# EAGLE design power_board (EAGLE 9.3.2)
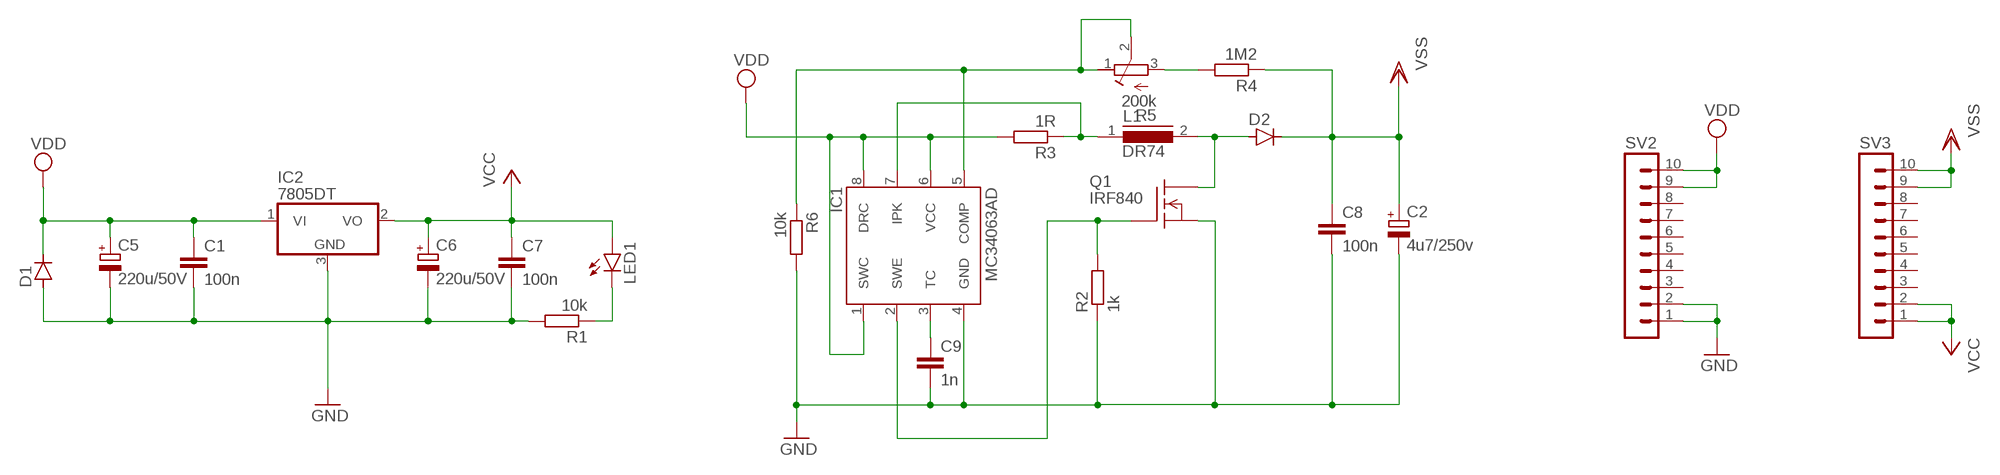
[diagram p0: schematic, sheet 1]

## Parts
C1  100n  C-EUC1206  [C1206]
C2  4u7/250v  CPOL-EUE5-10.5  [E5-10,5]
C5  220u/50V  CPOL-EU153CLV-1010  [153CLV-1010]
C6  220u/50V  CPOL-EU153CLV-1010  [153CLV-1010]
C7  100n  C-EUC1206  [C1206]
C8  100n  C-EUC1206  [C1206]
C9  1n  C-EUC1206  [C1206]
D1  D-SOD-80  [SOD80]
D2  D-SOD-80  [SOD80]
IC1  MC34063AD  [SO08]
IC2  7805DT  [TO252]
L1  DR74  [DR74]
LED1  LEDSMT1206  [1206]
Q1  IRF840  [TO220]
R1  10k  R-EU_R1206  [R1206]
R2  1k  R-EU_R1206  [R1206]
R3  1R  R-EU_R1206  [R1206]
R4  1M2  R-EU_R1206  [R1206]
R5  200k  R-TRIMM43P  [RTRIM43P]
R6  10k  R-EU_R1206  [R1206]
SV2  MA10-1  [MA10-1]
SV3  MA10-1  [MA10-1]

## Nets
GND: C1.2 C2.- C5.- C6.- C7.2 C8.2 C9.2 D1.2(A) IC1.4(GND) IC2.3(GND) Q1.3(S) R1.2 R2.1 R6.2 SV2.1 SV2.2
N$1: LED1.C R1.1
N$2: IC1.5(COMP) R5.1(E) R5.2(S) R6.1
N$3: IC1.7(IPK) L1.1 R3.1
N$4: D2.2(A) L1.2 Q1.2(D)
N$5: C9.1 IC1.3(TC)
N$7: IC1.2(SWE) Q1.1(G) R2.2
N$8: R4.2 R5.3(A)
VCC: C6.+ C7.1 IC2.2(VO) LED1.A SV3.1 SV3.2
VDD: C1.1 C5.+ D1.1(C) IC1.1(SWC) IC1.6(VCC) IC1.8(DRC) IC2.1(VI) R3.2 SV2.9 SV2.10
VSS: C2.+ C8.1 D2.1(C) R4.1 SV3.9 SV3.10
Unconnected: SV2.3 SV2.4 SV2.5 SV2.6 SV2.7 SV2.8 SV3.3 SV3.4 SV3.5 SV3.6 SV3.7 SV3.8

## Library data of the parts
C1 C7-C9 = rcl:C-EU: CAPACITOR, European symbol; SPICEPREFIX: C
C2 C5 C6 = rcl:CPOL-EU: POLARIZED CAPACITOR, European symbol; SPICEPREFIX: C
D1 D2 = semicon-smd-ipc:D-: DIODE unfilled
IC1 = v-reg-3:MC34063A: 1.5A Step-Up/Down/Inverting Switching Regulator NPN Darlington Switch, Vin 3V to 40V, Current Limiter Input, adjustable Frequency up to 100kHz
IC2 = linear:78*: Positive VOLTAGE REGULATOR Source: http://cache.national.com/ds/LM/LM78L05.pdf http://www.fairchildsemi.com/ds/LM/LM7805.pdf
L1 = inductors:DR74: High Power Density, High Efficiency, Shielded Inductors Source: coiltronics_dr_series.pdf; SPICEPREFIX: L
LED1 = led:LED: LED OSRAM: - CHIPLED LG R971, LG N971, LY N971, LG Q971, LY Q971, LO R971, LY R971 LH N974, LH R974 LS Q976, LO Q976, LY Q976 LO Q996 - Hyper CHIPLED LW Q18S LB Q993, LB Q99A, LB R99A - SideLED LS A670, LO A670, LY A670, LG A670, LP A670 LB A673, LV A673, LT A673, LW A673 LH A674 LY A675 LS A676, LA A676, LO A676, LY A676, LW A676 LS A679, LY A679, LG A679 - Hyper Micro SIDELED® LS Y876, LA Y876, LO Y876, LY Y876 LT Y87S - SmartLED LW L88C, LW L88S LB L89C, LB L89S, LG L890 LS L89K, LO L89K, LY L89K LS L896, LA L896, LO L896, LY L896 - TOPLED LS T670, LO T670, LY T670, LG T670, LP T670 LSG T670, LSP T670, LSY T670, LOP T670, LYG T670 LG T671, LOG T671, LSG T671 LB T673, LV T673, LT T673, LW T673 LH T674 LS T676, LA T676, LO T676, LY T676, LB T676, LH T676, LSB T676, LW T676 LB T67C, LV T67C, LT T67C, LS T67K, LO T67K, LY T67K, LW E67C LS E67B, LA E67B, LO E67B, LY E67B, LB E67C, LV E67C, LT E67C LW T67C LS T679, LY T679, LG T679 LS T770, LO T770, LY T770, LG T770, LP T770 LB T773, LV T773, LT T773, LW T773 LH T774 LS E675, LA E675, LY E675, LS T675 LS T776, LA T776, LO T776, LY T776, LB T776 LHGB T686 LT T68C, LB T68C - Hyper Mini TOPLED® LB M676 - Mini TOPLED Santana® LG M470 LS M47K, LO M47K, LY M47K Source: http://www.osram.convergy.de LUXEON: - LUMILED® LXK2-PW12-R00, LXK2-PW12-S00, LXK2-PW14-U00, LXK2-PW14-V00 LXK2-PM12-R00, LXK2-PM12-S00, LXK2-PM14-U00 LXK2-PE12-Q00, LXK2-PE12-R00, LXK2-PE12-S00, LXK2-PE14-T00, LXK2-PE14-U00 LXK2-PB12-K00, LXK2-PB12-L00, LXK2-PB12-M00, LXK2-PB14-N00, LXK2-PB14-P00, LXK2-PB14-Q00 LXK2-PR12-L00, LXK2-PR12-M00, LXK2-PR14-Q00, LXK2-PR14-R00 LXK2-PD12-Q00, LXK2-PD12-R00, LXK2-PD12-S00 LXK2-PH12-R00, LXK2-PH12-S00 LXK2-PL12-P00, LXK2-PL12-Q00, LXK2-PL12-R00 Source: www.luxeon.com KINGBRIGHT: KA-3528ASYC Source: www.kingbright.com
Q1 = transistor-fet:IRF840: N-Channel Enhancement MOSFET (HEXFET); 500V; 8A; 0,85Ohm
R1-R4 R6 = rcl:R-EU_: RESISTOR, European symbol; SPICEPREFIX: R
R5 = rcl:R-TRIMM: Trimm resistor; SPICEMODEL: X; SPICEPREFIXL: POT
SV2 SV3 = con-lstb:MA10-1: PIN HEADER; OC_FARNELL: unknown; OC_NEWARK: unknown

## Board
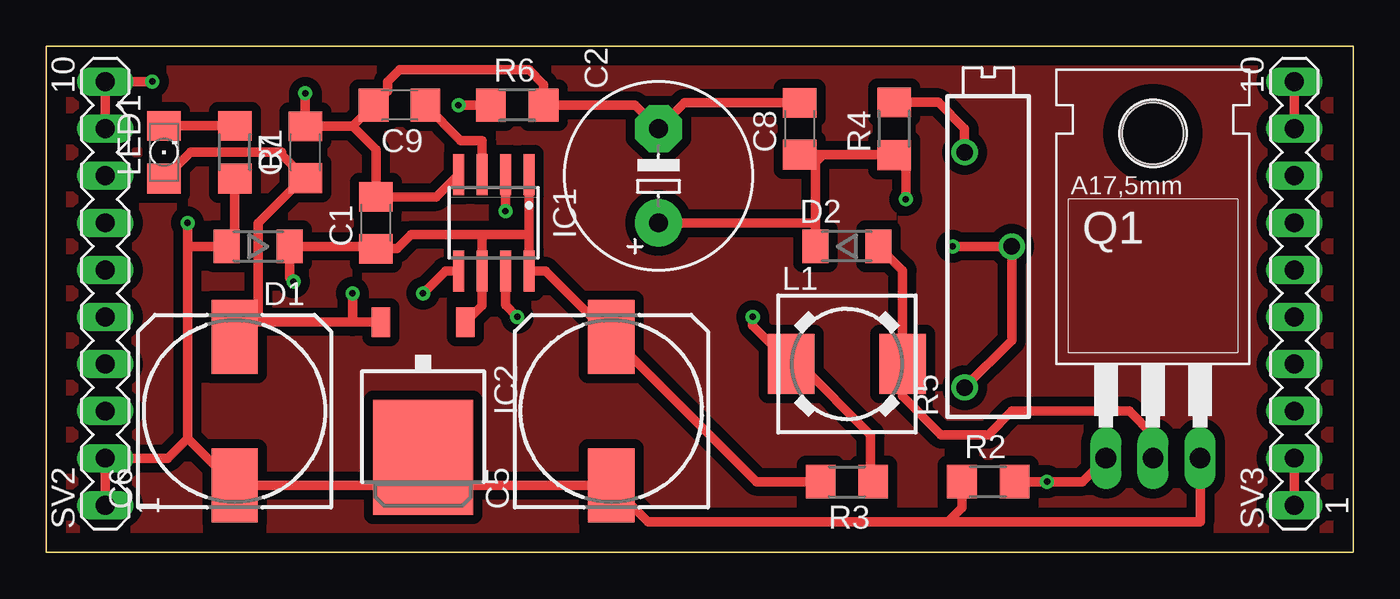
[diagram p1: board, top side]
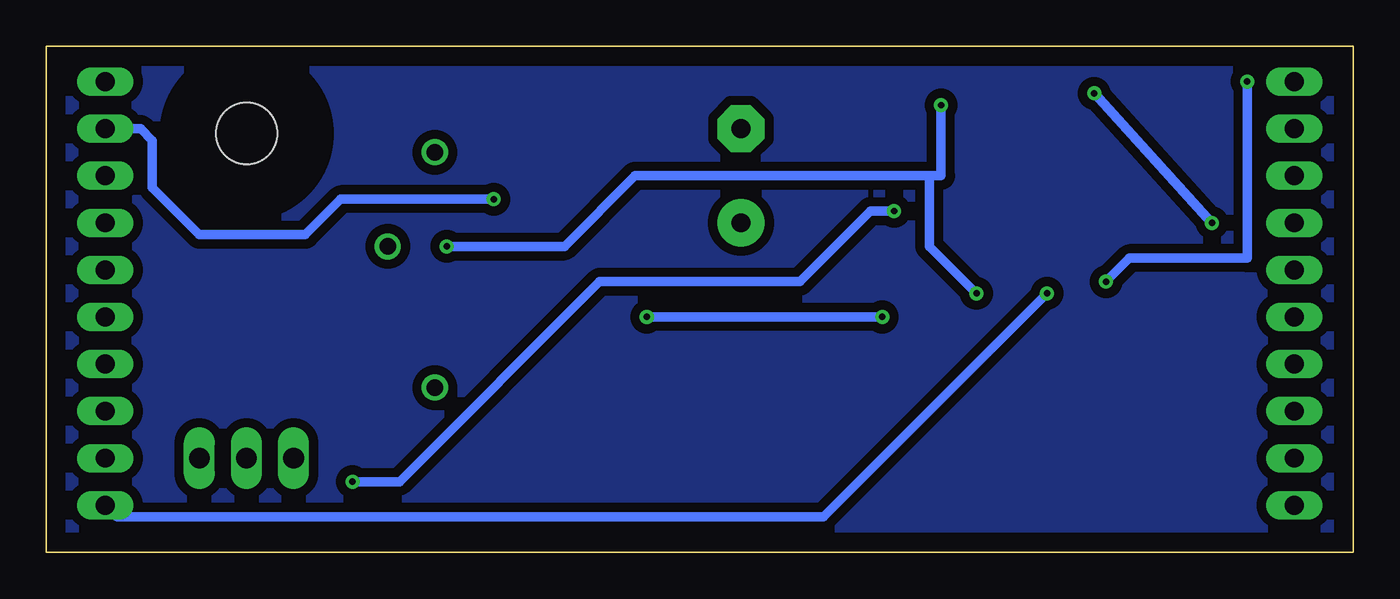
[diagram p2: board, bottom side, seen from below]

Size 70.48 x 27.3 mm. Coordinates in mm from the lower left corner, seen from the top.
Outline: 0,0 70.48,0 70.48,27.3 0,27.3 0,0
Copper layers (1*16): Top 0.035mm / dielectric 1.5mm / Bottom 0.035mm
Design rules "default": minimum track width 6mil, minimum drill 0.35mm, track to track 6mil, track to pad 6mil, pad to pad 6mil, via to via 6mil, smd to smd 6mil, copper to edge 40mil, drill to drill 6mil, minimum pad ring 10mil, minimum via ring 8mil, stop-mask expansion 4mil, vias tented up to drill 0mil, thermal gap 10mil

### Footprints (pad centres in the part's own frame; a part is rotated, then mirrored left to right if it is on the bottom)
C1206 = smd 1.6 x 1.8: 1 -1.4,0; 2 1.4,0
E5-10,5 = drill 1.016 pad 2.54: + -2.54,0 | drill 1.016 pad 2.54 octagon: - 2.54,0
153CLV-1010 = smd 4 x 2.5: + 4,0; - -4,0
SOD80 = smd 1.4 x 1.8: 1 -1.7,0; 2 1.7,0
SO08 = smd 0.6 x 2.2: 1 -1.905,-2.6; 2 -0.635,-2.6; 3 0.635,-2.6; 4 1.905,-2.6; 5 1.905,2.6; 6 0.635,2.6; 7 -0.635,2.6; 8 -1.905,2.6
TO252 = smd 1 x 1.6: 1 -2.28,-4.8; 2 2.28,-4.8 | smd 5.4 x 6.2: 3 0,2.5
DR74 = smd 2.5 x 3.25: 1 -3,0; 2 3,0
1206 = smd 1.6 x 1.803: A -1.422,0; C 1.422,0
TO220 = drill 1.118 long: 1 -2.54,-6.35; 2 0,-6.35; 3 2.54,-6.35 | hole 3.302: 0,11.176
R1206 = smd 1.6 x 1.803: 1 -1.422,0; 2 1.422,0
RTRIM43P = drill 0.9: 1 -7.62,1.27; 2 0,-1.27; 3 5.08,1.27
MA10-1 = drill 1.016 long: 1 -11.43,0; 2 -8.89,0; 3 -6.35,0; 4 -3.81,0; 5 -1.27,0; 6 1.27,0; 7 3.81,0; 8 6.35,0; 9 8.89,0; 10 11.43,0

### Placement (x,y rotation side)
C1  17.78,17.78 90 top
C2  33.02,20.32 90 top
C5  30.48,7.62 90 top
C6  10.16,7.62 90 top
C7  13.97,21.59 90 top
C8  40.64,22.86 90 top
C9  19.05,24.13 180 top
D1  11.43,16.51 180 top
D2  43.18,16.51 0 top
IC1  24.13,17.78 180 top
IC2  20.32,7.62 180 top
L1  43.18,10.16 0 top
LED1  6.35,21.59 90 top
Q1  59.69,11.43 0 top
R1  10.16,21.59 270 top
R2  50.8,3.81 0 top
R3  43.18,3.81 180 top
R4  45.72,22.86 90 top
R5  50.8,16.51 90 top
R6  25.4,24.13 0 top
SV2  3.17,13.97 90 top
SV3  67.31,13.97 90 top

### Tracks (layer width: path | path; a pad name or v marks a point on that pad's centre or on a via)
GND  (via drill 0.35)
  Top 0.508: 7.62,6.16 C6.- 18.82,3.62 IC2.3 21.82,3.62 C5.- 32.45,1.65 48.64,1.65 | 7.62,6.16 7.62,16.51 | 7.62,16.51 D1.2 10.16,16.94 R1.2 | 16.51,22.99 C7.2 v13.97,24.77 | 16.51,22.99 C9.2 18.41,24.89 18.41,25.4 19.05,26.04 26.04,26.04 26.82,25.25 R6.2 31.75,24.13 C2.- 34.42,24.26 C8.2 | 16.51,22.99 17.78,21.72 C1.2 21.02,19.18 IC1.4 | R2.1 49.38,2.39 48.64,1.65 | Q1.3 62.23,1.65 48.64,1.65 | 7.62,16.51 v7.62,17.78 | 7.62,6.16 6.54,5.08 SV2.2 SV2.1
  Bottom 0.508: v7.62,17.78 v13.97,24.77
N$1
  Top 0.508: LED1.C R1.1
N$2  (via drill 0.35)
  Top 0.508: R5.1 52.07,11.43 R5.2 v48.9,16.51 | IC1.5 21.53,15.18 v20.32,13.97 | v22.23,24.13 R6.1
  Bottom 0.508: v20.32,13.97 22.86,16.51 22.86,20.32 | v22.23,24.13 22.23,20.32 22.86,20.32 | v48.9,16.51 42.55,16.51 38.73,20.32 22.86,20.32
N$3  (via drill 0.35)
  Top 0.508: R3.1 44.45,3.96 44.45,6.35 40.64,10.16 L1.1 38.1,12.24 v38.1,12.7 | IC1.7 24.77,13.34 v25.4,12.7
  Bottom 0.508: v25.4,12.7 v38.1,12.7
N$4
  Top 0.508: D2.2 46.18,15.21 L1.2 46.18,8.43 48.26,6.35 50.8,6.35 52.07,7.62 58.42,7.62 59.69,6.35 Q1.2
N$5
  Top 0.508: C9.1 22.36,22.23 23.5,22.23 IC1.3
N$6
  pour Top (isolate 0.5): 0,0 70.48,0 70.48,27.3 0,27.3
N$7  (via drill 0.35)
  Top 0.508: R2.2 v53.98,3.81 55.88,3.81 Q1.1 | v24.77,18.41 IC1.2
  Bottom 0.508: v53.98,3.81 51.44,3.81 40.64,14.61 29.84,14.61 26.04,18.41 v24.77,18.41
N$8
  Top 0.508: R5.3 49.53,22.86 48.11,24.28 R4.2
N$9
  pour Bottom (isolate 0.5): 0,0 70.48,0 70.48,27.3 0,27.3
VCC  (via drill 0.35)
  Top 0.508: IC2.2 16.51,12.42 | 16.51,12.42 10.96,12.42 C6.+ 11.43,12.89 11.43,17.78 13.84,20.19 C7.1 12.7,21.46 12.7,21.59 7.77,21.59 LED1.A | SV3.1 SV3.2 | 16.51,12.42 v16.51,13.97
  Bottom 0.508: v16.51,13.97 28.57,1.91 66.67,1.91 SV3.1
VDD  (via drill 0.35)
  Top 0.508: IC1.1 26.04,17.14 | 26.04,17.14 IC1.8 26.92,15.18 C5.+ 38.29,3.81 R3.2 | 23.5,17.14 IC1.6 23.5,13.31 IC2.1 | 23.5,17.14 19.68,17.14 18.92,16.38 C1.1 17.65,16.51 D1.1 13.13,14.81 v13.34,14.61 | 23.5,17.14 26.04,17.14 | SV2.9 SV2.10 v5.71,25.4
  Bottom 0.508: v5.71,25.4 5.71,15.88 12.06,15.88 v13.34,14.61
VSS  (via drill 0.35)
  Top 0.508: C8.1 41.91,21.46 | 41.91,21.46 45.7,21.46 R4.1 46.35,20.8 v46.35,19.05 | D2.1 41.48,17.78 | 41.48,17.78 41.48,21.03 41.91,21.46 | C2.+ 41.48,17.78 | SV3.10 SV3.9
  Bottom 0.508: SV3.9 65.41,22.86 64.77,22.23 64.77,19.68 62.23,17.14 56.52,17.14 54.61,19.05 v46.35,19.05